# EasyEDA schematic schematics-easyEDA.json
TITLE: Binary Timer (ID220 Homework 3); REV: 1.1; Date: 2021-09-10; Sheet: 1/1; Drawn By: Andrea; Company: Andrea Bianchi
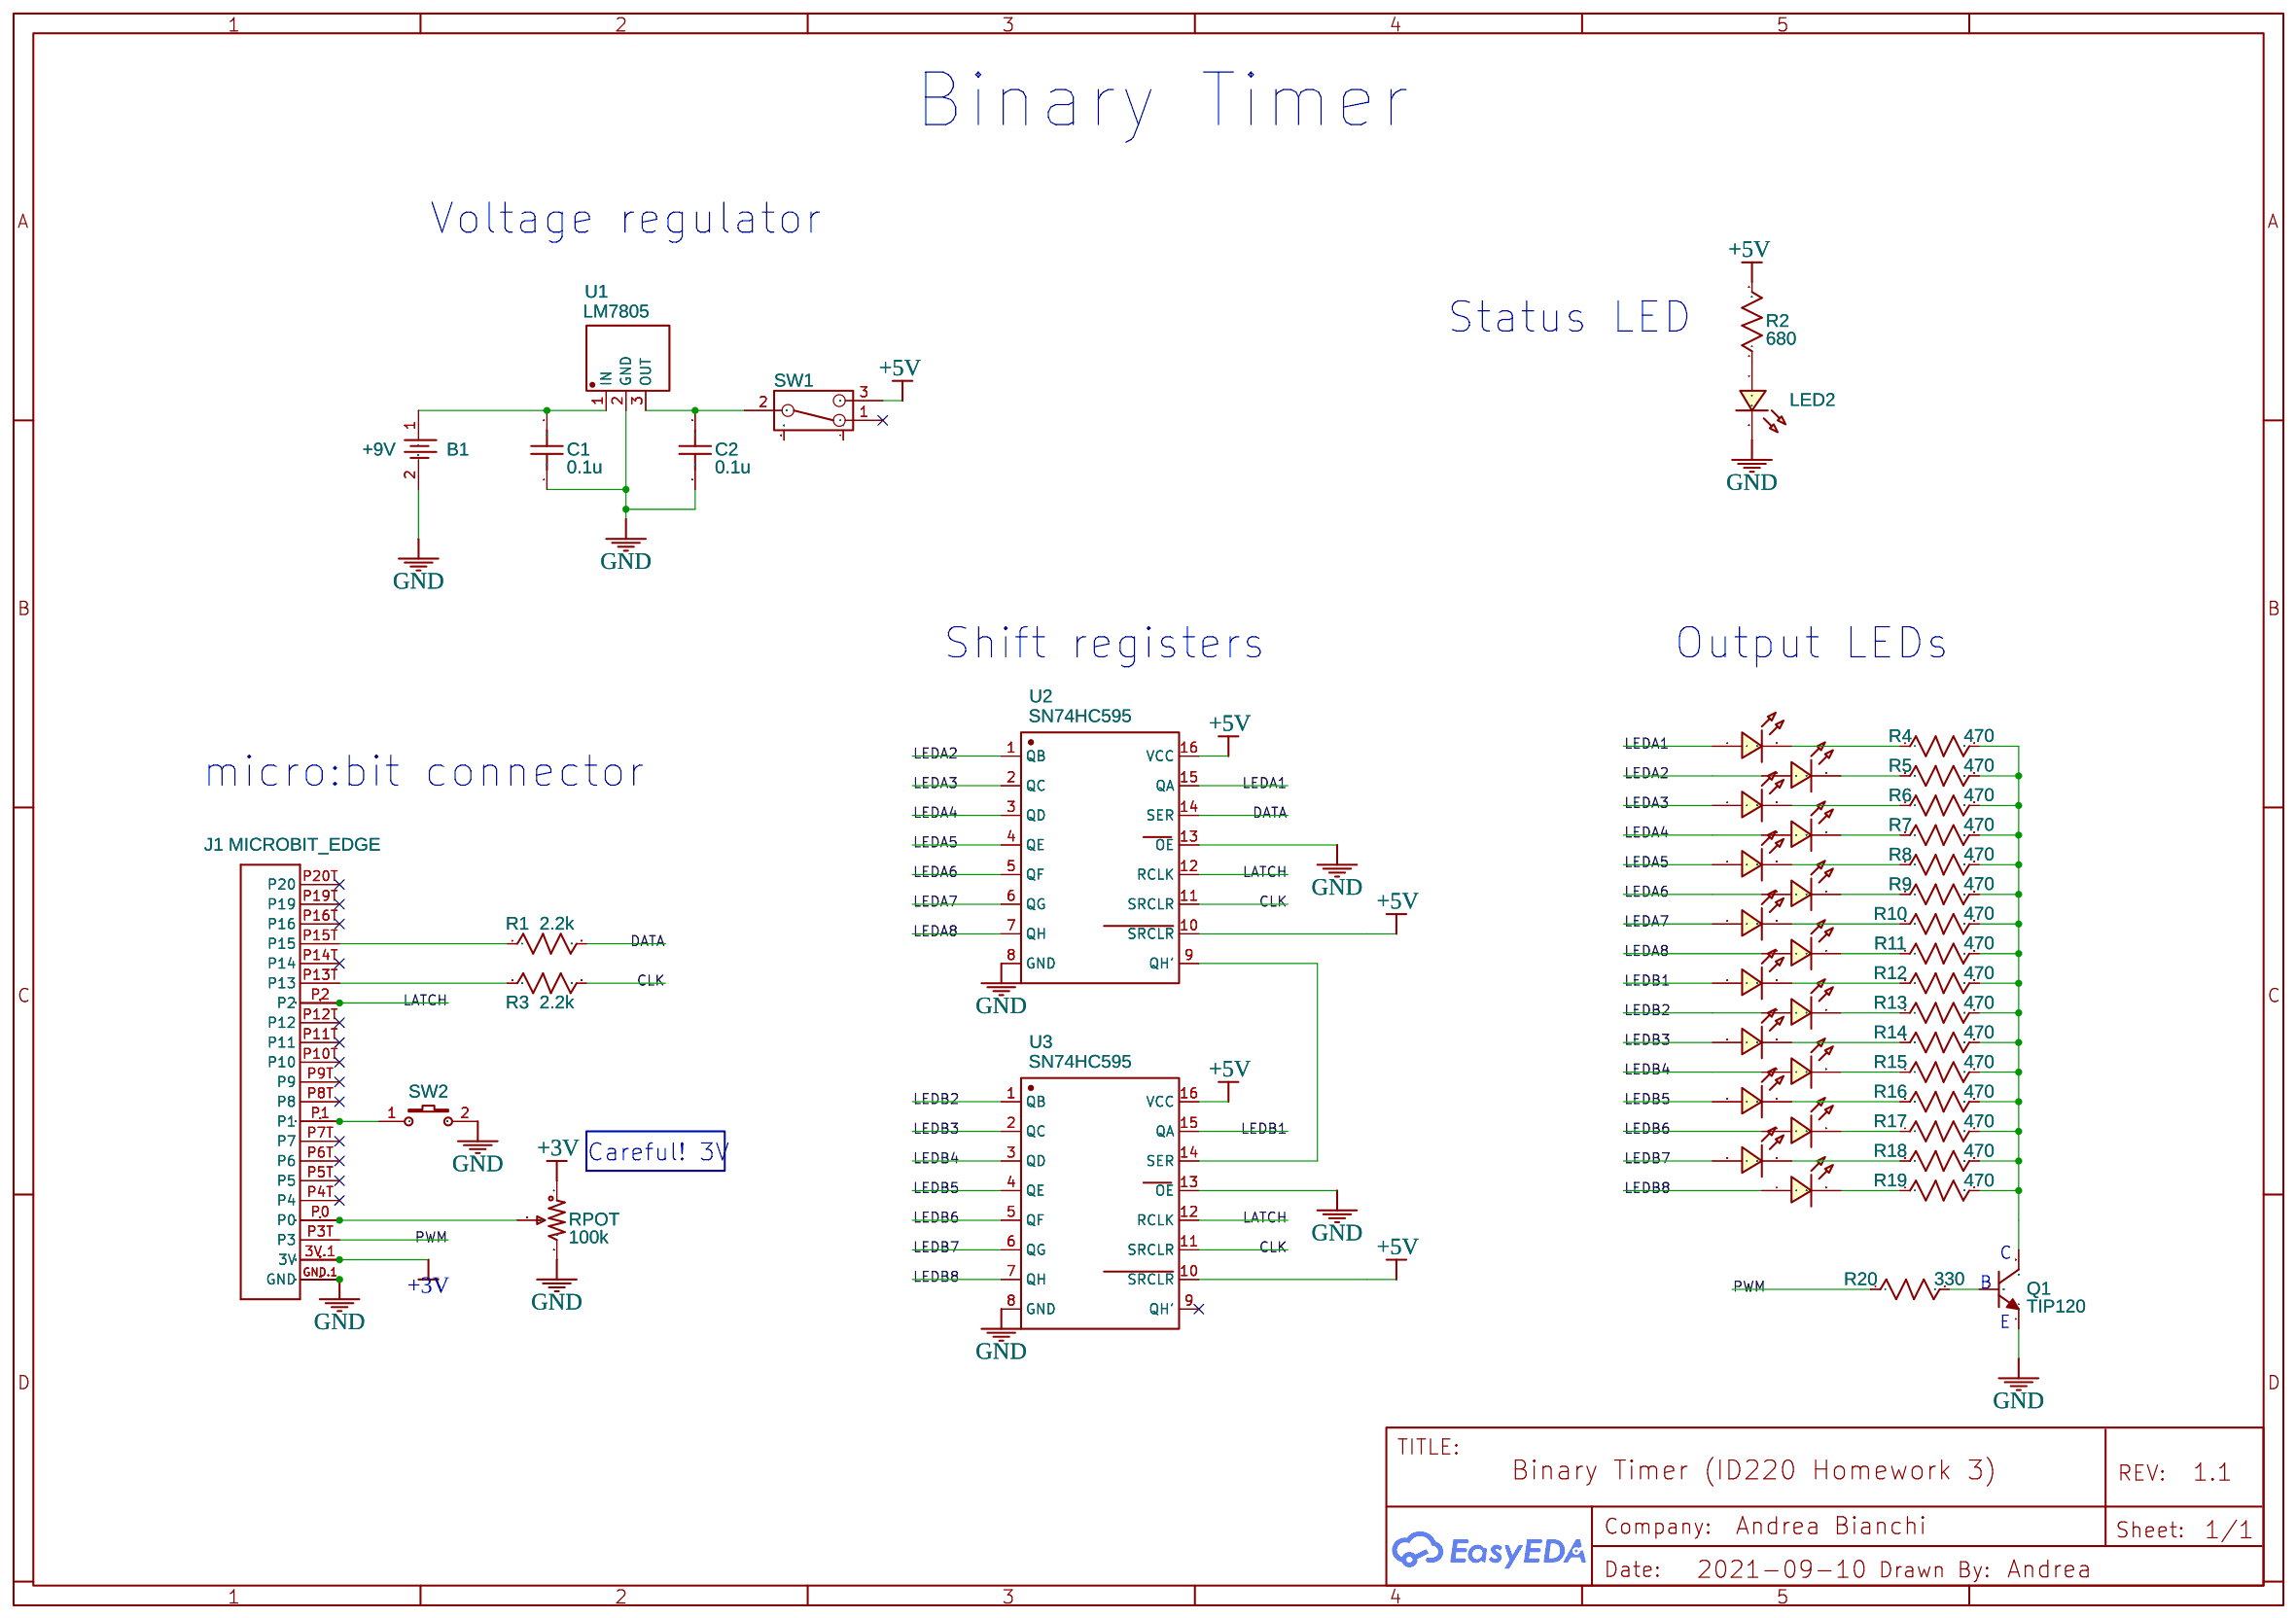
[diagram p0: schematic sheet]

## Parts
1  J1 MICROBIT_EDGE  [MICROBIT_EDGE]
B1  +9V  [BAT-SMD_CR1220-2]
C1  0.1u  [C0603]
C2  0.1u  [C0603]
LED1  LED-0603_R  [LED0603_RED]
LED2  LED-0603_R  [LED0603_RED]
LED3  LED-0603_R  [LED0603_RED]
LED4  LED-0603_R  [LED0603_RED]
LED5  LED-0603_R  [LED0603_RED]
LED6  LED-0603_R  [LED0603_RED]
LED7  LED-0603_R  [LED0603_RED]
LED8  LED-0603_R  [LED0603_RED]
LED9  LED-0603_R  [LED0603_RED]
LED10  LED-0603_R  [LED0603_RED]
LED11  LED-0603_R  [LED0603_RED]
LED12  LED-0603_R  [LED0603_RED]
LED13  LED-0603_R  [LED0603_RED]
LED14  LED-0603_R  [LED0603_RED]
LED15  LED-0603_R  [LED0603_RED]
LED16  LED-0603_R  [LED0603_RED]
LED17  LED-0603_R  [LED0603_RED]
Q1  TIP120  [SOT-23-3_L2.9-W1.3-P1.90-LS2.4-TR]
R1  2.2k  [R0603]
R2  680  [R0603]
R3  2.2k  [R0603]
R4  470  [R0603]
R5  470  [R0603]
R6  470  [R0603]
R7  470  [R0603]
R8  470  [R0603]
R9  470  [R0603]
R10  470  [R0603]
R11  470  [R0603]
R12  470  [R0603]
R13  470  [R0603]
R14  470  [R0603]
R15  470  [R0603]
R16  470  [R0603]
R17  470  [R0603]
R18  470  [R0603]
R19  470  [R0603]
R20  330  [R0603]
RPOT  100k  [RES-ADJ-TH_3386P]
SW1  SK-12D02-VG5  [SW-TH_SK-12D02VG3]
SW2  K2-3.6×6.1_SMD  [KEY-SMD_2P-L6.2-W3.6-LS8.0]
U1  LM7805  [TO-220-3_L10.0-W4.5-P2.54-L]
U2  SN74HC595  [SOIC-16]
U3  SN74HC595  [SOIC-16]

## Library data of the parts
1 = MICROBIT_EDGE: Contributor: Clément Amblard
B1 = CR1220-2: Supplier: LCSC; Manufacturer: Q&J; image: //image.lceda.cn/szlcsc/C70381.jpg; Supplier Part: C70381
C1 C2 = C_0603_US: Contributor: LCEDA_Lib
LED1-LED17 = LED-0603_R: Manufacturer: EVERLIGHT(台湾亿光); Manufacturer Part: 19-217/R6C-AL1M2VY/3T; Supplier Part: C72044; Supplier: LCSC; Contributor: LCEDA_01
Q1 = 2N3904(SOT-23): Supplier: LCSC; Manufacturer: KEC; Manufacturer Part: 2n3904S-RTK/PS; Supplier Part: C18536; Paste Type: SOT-23; Contributor: LCEDA_Lib
R1-R20 = R_0603_US: Contributor: LCEDA_Lib
RPOT = R_3386P_US: Supplier: LCSC; Contributor: LCEDA_Lib; value(Ω): 10K; Package Display: No
SW1 = SK-12D02-VG5: Supplier: LCSC; Supplier Part: C136722; Manufacturer: Rectangular Connectors - Contacts; Contributor: LCSC
SW2 = K2-3.6×6.1_SMD: Supplier Part: C118141; Supplier: LCSC; Manufacturer Part: K2-1107ST-A4SW-06; Contributor: LCEDA_Lib; 制造商: 韩国韩荣; Package Display: No
U1 = LM7805CT: Supplier: LCSC; Manufacturer: FAIRCHILD; Supplier Part: C22146
U2 U3 = SN74HC595: Contributor: lolologe

## Nets
+3V: 1.3V.1(3V) 1.3V.2(3V) 1.3VT(3V) 1.3VT.1(3V) 1.3VT.2(3V) RPOT.1
+5V: R2.2 SW1.3 U2.10(SRCLR) U2.16(VCC) U3.10(SRCLR) U3.16(VCC)
GND: 1.GND.1(GND) 1.GND.2(GND) 1.GNDT(GND) 1.GNDT.1(GND) 1.GNDT.2(GND) B1.2 C1.1 C2.1 LED2.2 Q1.1(E) RPOT.3 SW2.2 U1.2(GND) U2.8(GND) U2.13(OE) U3.8(GND) U3.13(OE)
CLK: R3.2 U2.11(SRCLR) U3.11(SRCLR)
DATA: R1.2 U2.14(SER)
LATCH: 1.P2 1.P2.1(P2) 1.P2T(P2) U2.12(RCLK) U3.12(RCLK)
LEDA1: LED1.1 U2.15(QA)
LEDA2: LED3.1 U2.1(QB)
LEDA3: LED5.1 U2.2(QC)
LEDA4: LED4.1 U2.3(QD)
LEDA5: LED7.1 U2.4(QE)
LEDA6: LED6.1 U2.5(QF)
LEDA7: LED9.1 U2.6(QG)
LEDA8: LED8.1 U2.7(QH)
LEDB1: LED11.1 U3.15(QA)
LEDB2: LED10.1 U3.1(QB)
LEDB3: LED13.1 U3.2(QC)
LEDB4: LED12.1 U3.3(QD)
LEDB5: LED15.1 U3.4(QE)
LEDB6: LED14.1 U3.5(QF)
LEDB7: LED17.1 U3.6(QG)
LEDB8: LED16.1 U3.7(QH)
PWM: 1.P3T(P3) R20.1
Net-(1-P0): 1.P0 1.P0,1(P0) 1.P0T(P0) RPOT.2
Net-(1-P1): 1.P1 1.P1.1(P1) 1.P1T(P1) SW2.1
Net-(1-P13T): 1.P13T(P13) R3.1
Net-(1-P15T): 1.P15T(P15) R1.1
Net-(B1-1): B1.1 C1.2 U1.1(IN)
Net-(C2-2): C2.2 SW1.2 U1.3(OUT)
Net-(LED1-2): LED1.2 R4.1
Net-(LED2-1): LED2.1 R2.1
Net-(LED3-2): LED3.2 R5.1
Net-(LED4-2): LED4.2 R7.1
Net-(LED5-2): LED5.2 R6.1
Net-(LED6-2): LED6.2 R9.1
Net-(LED7-2): LED7.2 R8.1
Net-(LED8-2): LED8.2 R11.1
Net-(LED9-2): LED9.2 R10.1
Net-(LED10-2): LED10.2 R13.1
Net-(LED11-2): LED11.2 R12.1
Net-(LED12-2): LED12.2 R15.1
Net-(LED13-2): LED13.2 R14.1
Net-(LED14-2): LED14.2 R17.1
Net-(LED15-2): LED15.2 R16.1
Net-(LED16-2): LED16.2 R19.1
Net-(LED17-2): LED17.2 R18.1
Net-(Q1-2): Q1.2(B) R20.2
Net-(Q1-3): Q1.3(C) R4.2 R5.2 R6.2 R7.2 R8.2 R9.2 R10.2 R11.2 R12.2 R13.2 R14.2 R15.2 R16.2 R17.2 R18.2 R19.2
Net-(U2-9): U2.9(QH') U3.14(SER)

Not connected (* = marked no-connect by the designer): 1 P4T(P4)* P5T(P5)* P6T(P6)* P7T(P7)* P8T(P8)* P9T(P9)* P10T(P10)* P11T(P11)* P12T(P12)* P14T(P14)* P16T(P16)* P19T(P19)* P20T(P20)*; SW1 1* 4 5; U3 9(QH')*

## Notes on the sheet
- Binary Timer
- Voltage regulator
- Status LED
- Shift registers
- Output LEDs
- micro:bit connector
- Careful! 3V
- C
- B
- E
